# Altium schematic sheet atuador_geral.SchDoc
size A4
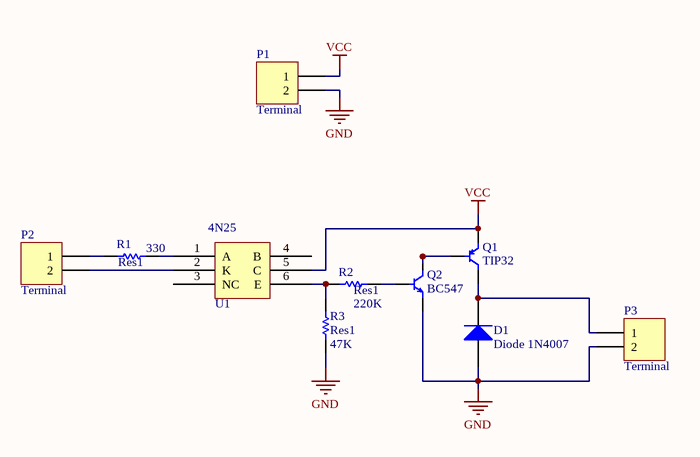
[diagram p0: atuador_geral.SchDoc]

## Parts
D1  Diode 1N4007  [DO-41]
P1  Terminal  [KRE_2]
P2  Terminal  [KRE_2]
P3  Terminal  [KRE_2]
Q1  TIP32  [TO-220/BCE]
Q2  BC547  [TO-92/CBE]
R1  Res1  value 330  [AXIAL-0.3]
R2  Res1  value 220K  [AXIAL-0.3]
R3  Res1  value 47K  [AXIAL-0.3]
U1  4N25  [4N25]

## Nets
GND: D1.1(A) P1.2 P3.2 Q2.E R3.1
VCC: P1.1 Q1.E U1.5(C)
NetD1_2: D1.2(K) P3.1 Q1.C
NetP2_1: P2.1 R1.1
NetP2_2: P2.2 U1.2(K)
NetQ1_B: Q1.B Q2.C
NetQ2_B: Q2.B R2.2
NetR1_2: R1.2 U1.1(A)
NetR2_1: R2.1 R3.2 U1.6(E)

Not connected (* = marked no-connect by the designer): U1 3(NC) 4(B)

## Library data of the parts
D1 = Diode 1N4007: 1 Amp General Purpose Rectifier; Published: 8-Jun-2000; LatestRevisionDate: 17-Jul-2002; LatestRevisionNote: Re-released for DXP Platform.; DatasheetVersion: 1998; PackageVersion: Aug-1999; PackageReference: DO-41; Publisher: Altium Limited; PackageDescription: Diode, Axial; Body 5.2 x 2.7 mm (LxDia. max), Lead Dia. 0.86 mm (max); Code_JEDEC: DO-204-AL; ComponentLink1Description: Manufacturer Link; ComponentLink1URL: http://www.fairchildsemi.com/; ComponentLink2Description: Datasheet; ComponentLink2URL: http://www.fairchildsemi.com/ds/1N%2F1N4001.pdf
P1-P3 = KRE_2: Terminal Block 1x2
Q1 = TIP32: PNP Epitaxial Silicon Transistor; Complementary Part: TIP31; Collector-Base Voltage (Vcb): -40 V; Emitter-Base Voltage (Veb): -5 V; Collector Current (Ic): -3 A; Collector Peak Current (Icp): -5 A; Total Power Dissipation (Ptot): 40 W; DC Current Gain Min (hfe): 10; DC Current Gain Max (hfe): 50; Transition Frequency (fT): 3 MHz; Collector-Emitter Voltage (Vce): -40 V; Base Peak Current (Ibp): -3 A
Q2 = BC547: NPN Epitaxial Silicon Transistor; Complementary Part: BC557; Collector-Base Voltage (Vcb): 50 V; Collector-Emitter Voltage (Vce): 45 V; Emitter-Base Voltage (Veb): 6 V; Collector Current (Ic): 100 mA; Total Power Dissipation (Ptot): 500 mW; DC Current Gain Min (hfe): 110; DC Current Gain Max (hfe): 800; Transition Frequency (fT): 300 MHz
R1-R3 = Res1: Resistor; Published: 8-Jun-2000; LatestRevisionDate: 17-Jul-2002; LatestRevisionNote: Re-released for DXP Platform.; PackageReference: AXIAL-0.3; Publisher: Altium Limited; PackageDescription: Axial Device, Thru-Hole; 2 Leads; 0.3 in Pin Spacing